# EasyEDA Pro project ProPrj_trying to make a watch__2026-06-22.epro, schematic Schematic1_7
Board Name: new board; Create Date: 2026-05-27; Page Name: P1; Project Name: trying to make a watch?; Schematic Name: Schematic1_7; Update Date: 2026-05-31; Company: EasyEDA.com; Page Size: A4; Version: V1.0
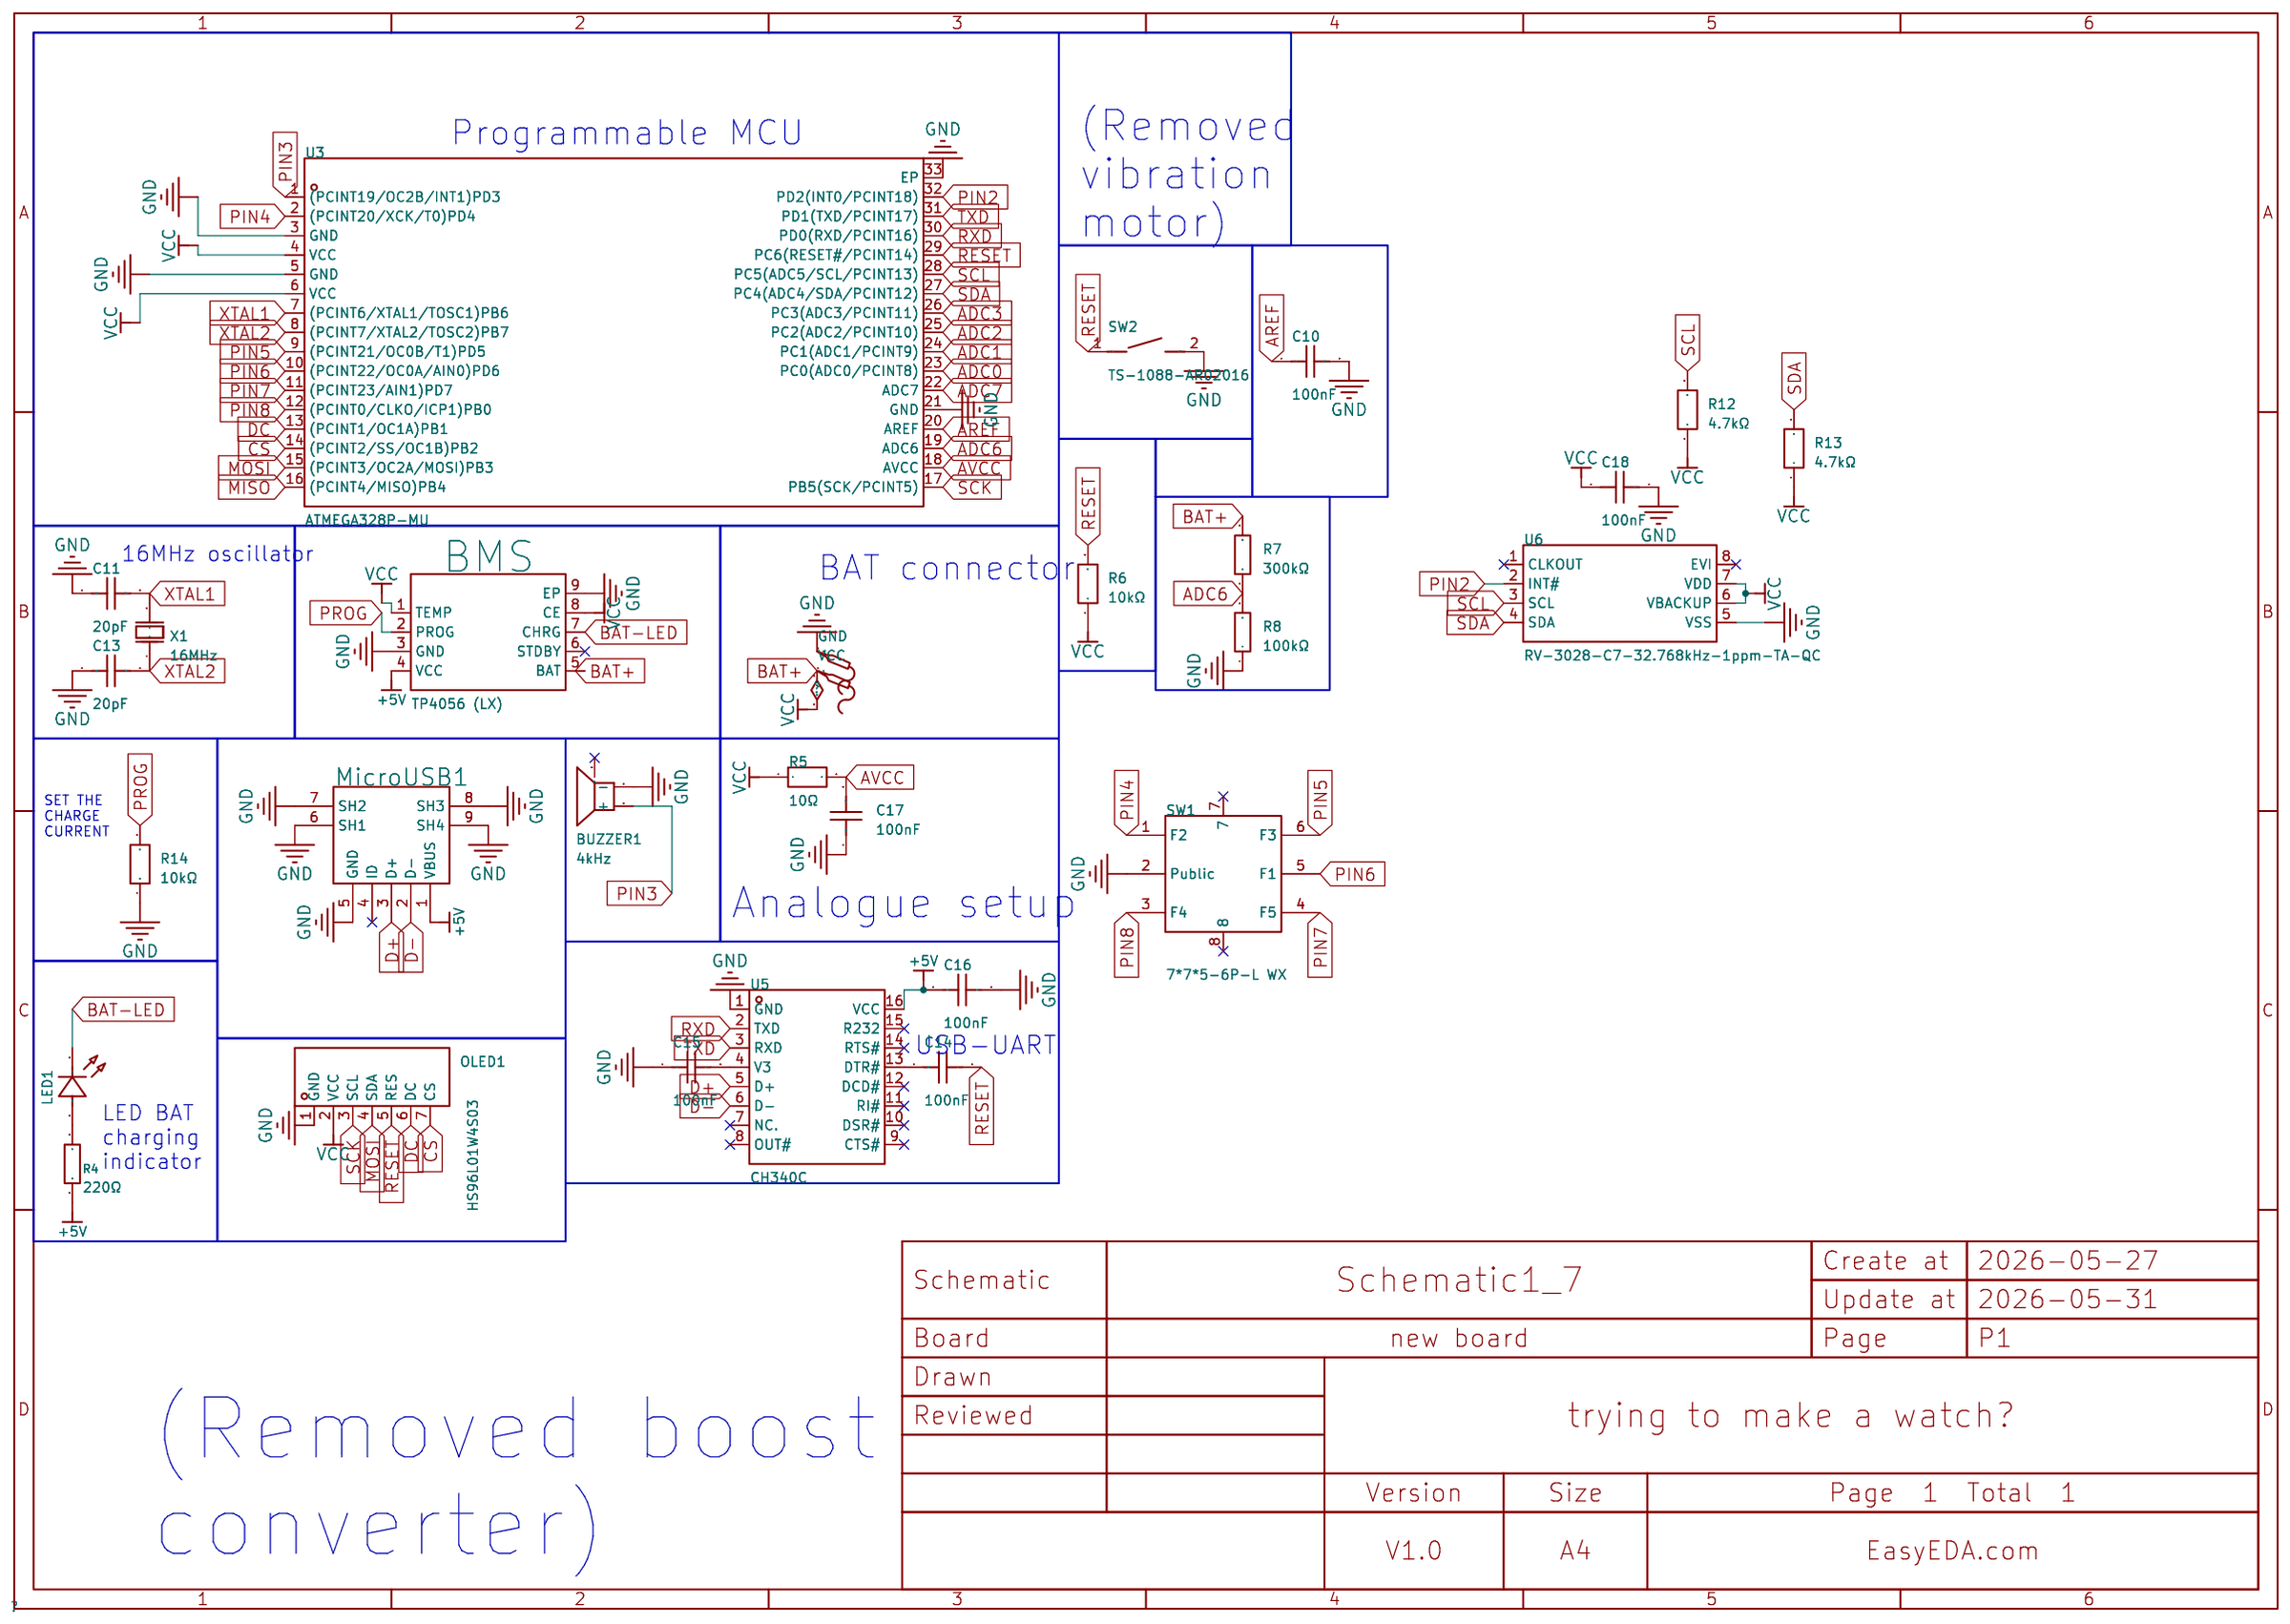
[diagram p0: schematic sheet]

## Parts
BMS  TP4056 (LX)  [ESOP-8_L4.9-W3.9-P1.27-LS6.0-BL-EP]
BUZZER1  4kHz  [BUZ-SMD_L5.0-W5.5-P4.60]
C10  100nF  [C0402]
C11  20pF  [C0402]
C13  20pF  [C0402]
C14  100nF  [C0402]
C15  100nF  [C0402]
C16  100nF  [C0402]
C17  100nF  [C0402]
C18  100nF  [C0402]
GND  -  [Test-Point-0.5mm]
LED1  XL-1608SURC-06  [LED0603-RD_RED]
MicroUSB1  MicroXNJ  [MICRO-USB-SMD_MICROXNJ_1]
OLED1  HS96L01W4S03  [OLED-TH_HS96L01W4S03]
R4  220Ω  [R0402]
R5  10Ω  [R0603]
R6  10kΩ  [R0402]
R7  300kΩ  [R0603]
R8  100kΩ  [R0402]
R12  4.7kΩ  [R0402]
R13  4.7kΩ  [R0402]
R14  10kΩ  [R0402]
SW1  7*7*5-6P-L WX  [SW-SMD_8P-L7.0-W7.0-P1.40-LS7.4-TL]
SW2  TS-1088-AR02016  [SW-SMD_L3.9-W3.0-P4.45]
U3  ATMEGA328P-MU  [HVQFN-32_L5.0-W5.0-P0.50-TL-EP3.1]
U5  CH340C  [SOP-16_L10.0-W3.9-P1.27-LS6.0-BL]
U6  RV-3028-C7-32.768kHz-1ppm-TA-QC  [OSC-SMD_8P-L3.2-W1.5-P0.90-BL]
VCC  -  [Test-Point-0.5mm]
X1  16MHz  [OSC-SMD_2P-L5.0-W3.2]

## Library data of the parts
BMS = TP4056 (LX): The Chip Type:Charging IC Voltage - Supply:4.5V~5.5V Voltage - Supply:4.5V~5.5V Charge Current - Max:1A Charging Saturation Voltage:4.2V End-Off Voltage:- Type of Battery:Lithium Battery Number of Cells:1 Number of Cells:1 Operating Temperature:-40℃~+85℃; LCSC Part Name: 1A线性锂电池充电电路; Supplier Part: C49246856; Manufacturer: LX(灵星芯微); Supplier Footprint: ESOP-8; JLCPCB Part Class: Extended Part; Datasheet: https://item.szlcsc.com/datasheet/TP4056%2520(LX)/51674740.html; Supplier: LCSC; The Chip Type: Charging IC; Voltage - Supply: 4.5V~5.5V; Charge Current - Max: 1A; Charging Saturation Voltage: 4.2V; Type of Battery: Lithium Battery; Number of Cells: 1; Operating Temperature: -40℃~+85℃; Battery Temperature Detection: Support; Supply Current (Iq): 70uA
BUZZER1 = MLT-5020: Driver Circuitry:Passive (Externally Driven) Technology:Electromagnetic Voltage Rating:3V Voltage - Supply:2V~4V Voltage - Supply:2V~4V Frequency:4kHz Current Consumption:100mA Sound Pressure Level(SPL):75dB Length:5.2mm Width:5.2mm Height:2.5mm Operating; LCSC Part Name: 无源(外部驱动) 电磁式 4kHz; Supplier Part: C94598; Manufacturer: 华能; Supplier Footprint: SMD,5x5mm; JLCPCB Part Class: Extended Part; Datasheet: https://item.szlcsc.com/datasheet/MLT-5020/95796.html; Supplier: LCSC; Driver Circuitry: Passive (Externally Driven); Technology: Electromagnetic; Voltage Rating: 3V; Voltage - Supply: 2V~4V; Current Consumption: 100mA; Sound Pressure Level(SPL): 75dB; Length: 5.2mm; Width: 5.2mm; Height: 2.5mm; Operating Temperature: -20℃~+70℃
C10 C14-C18 = CL05B104KO5NNNC: Capacitance:100nF Tolerance:±10% Tolerance:±10% Voltage Rating:16V Temperature Coefficient:X7R; LCSC Part Name: 100nF ±10% 16V; Supplier Part: C1525; Manufacturer: SAMSUNG(三星); Supplier Footprint: 0402; JLCPCB Part Class: Basic Part; Datasheet: https://item.szlcsc.com/datasheet/CL05B104KO5NNNC/1877.html; Supplier: LCSC; Tolerance: ±10%; Voltage Rating: 16V; Temperature Coefficient: X7R
C11 C13 = 0402CG200J500NT: Capacitance:20pF Tolerance:±5% Tolerance:±5% Voltage Rating:50V Temperature Coefficient:C0G; LCSC Part Name: 20pF ±5% 50V; Supplier Part: C1554; Manufacturer: FH(风华); Supplier Footprint: 0402; JLCPCB Part Class: Basic Part; Datasheet: https://item.szlcsc.com/datasheet/0402CG200J500NT/1906.html; Supplier: LCSC; Tolerance: ±5%; Voltage Rating: 50V; Temperature Coefficient: C0G
GND VCC = Test-Point: Test Point 测试点
LED1 = XL-1608SURC-06: Lamp Holder Type:- Illumination Color:Red Voltage - Forward(Vf):2.3V Voltage - Forward(Vf):2.3V Power(Watts):50mW Forward Current:20mA Wavelength - Dominant:620nm~630nm Wavelength - Dominant:620nm~630nm Peak Wavelength:625nm Diode Configuration:- Lens Col; Supplier Part: C965799; Manufacturer: XINGLIGHT(成兴光); Supplier Footprint: 0603; JLCPCB Part Class: Extended Part; Datasheet: https://atta.szlcsc.com/upload/public/pdf/source/20250213/F9766CE804AF391355DCDD48DB3E0DAB.pdf; Supplier: LCSC; Illumination Color: Red; Voltage - Forward(Vf): 2.3V; Power(Watts): 50mW; Forward Current: 20mA; Wavelength - Dominant: 620nm~630nm; Peak Wavelength: 625nm; Lens Color: Colorless Transparent Lens; Luminous Intensity: 225mcd; Viewing Angle: 120°; Mounting Sytle: Positive Stick; Operating Temperature: -20℃~+85℃
MicroUSB1 = MicroXNJ: Connector Type:Micro-B Protocol Standard:USB 2.0 Gender:Female Mounting Type:Surface Mount, Right Angle Number of Contacts:5P Number of Ports:1 Current Rating-Power:1.8A Voltage Rating:30V Connect-Disconnect Life:5,000 times Detection color:Black Operatin; LCSC Part Name: Micro小牛角卧贴母座; Supplier Part: C404969; Manufacturer: SHOU HAN(首韩); Supplier Footprint: SMD; JLCPCB Part Class: Extended Part; Datasheet: https://item.szlcsc.com/datasheet/MicroXNJ/392534.html; Supplier: LCSC; Connector Type: Micro-B; Protocol Standard: USB 2.0; Gender: Female; Mounting Type: Surface Mount, Right Angle; Number of Contacts: 5P; Number of Ports: 1; Current Rating-Power: 1.8A; Voltage Rating: 30V; Connect-Disconnect Life: 5,000 times; Detection color: Black; Operating Temperature: -20℃~+85℃
OLED1 = HS96L01W4S03: Size:0.96 Dot Pixels:128x64 Operating Temperature:-40℃~+80℃ Operating Temperature:-40℃~+80℃ Type of Drive:Passive (PMOLED) Display Range:21.74x10.86mm Display Color:White Luminance:100cd/m2 Quiescent Current:5uA; LCSC Part Name: 0.96寸 白光 128x64像素分辨率; Supplier Part: C5139758; Manufacturer: HS(汉昇); JLCPCB Part Class: Extended Part; Datasheet: https://item.szlcsc.com/datasheet/HS96L01W4S03/5751920.html; Supplier: LCSC; Size: 0.96; Dot Pixels: 128x64; Operating Temperature: -40℃~+80℃; Type of Drive: Passive (PMOLED); Display Range: 21.74x10.86mm; Display Color: White; Luminance: 100cd/m2; Quiescent Current: 5uA
R4 = 0402WGF2200TCE: Type:Thick Film Resistor Resistance:220Ω Tolerance:±1% Tolerance:±1% Power(Watts):62.5mW Voltage-Supply(Max):50V Temperature Coefficient:±100ppm/℃ Temperature Coefficient:±100ppm/℃ Operating Temperature:-55℃~+155℃ Operating Temperature:-55℃~+155℃; LCSC Part Name: 220Ω ±1% 62.5mW 厚膜电阻; Supplier Part: C25091; Manufacturer: UNI-ROYAL(厚声); Supplier Footprint: 0402; JLCPCB Part Class: Basic Part; Datasheet: https://item.szlcsc.com/datasheet/0402WGF2200TCE/25834.html; Supplier: LCSC; Type: Thick Film Resistor; Tolerance: ±1%; Power(Watts): 62.5mW; Voltage-Supply(Max): 50V; Temperature Coefficient: ±100ppm/℃; Operating Temperature: -55℃~+155℃
R5 = FRC0603J100 TS: Type:Thick Film Resistor Resistance:10Ω Tolerance:±5% Tolerance:±5% Power(Watts):100mW Voltage-Supply(Max):75V Temperature Coefficient:±100ppm/℃ Temperature Coefficient:±100ppm/℃ Operating Temperature:-55℃~+155℃ Operating Temperature:-55℃~+155℃; LCSC Part Name: 10Ω ±5% 100mW 厚膜电阻; Supplier Part: C2907091; Manufacturer: FOJAN(富捷); Supplier Footprint: 0603; JLCPCB Part Class: Extended Part; Supplier: LCSC; Type: Thick Film Resistor; Tolerance: ±5%; Power(Watts): 100mW; Voltage-Supply(Max): 75V; Temperature Coefficient: ±100ppm/℃; Operating Temperature: -55℃~+155℃
R6 R14 = AC0402FR-0710KL: Type:Thick Film Resistor Resistance:10kΩ Tolerance:±1% Tolerance:±1% Power(Watts):62.5mW Voltage-Supply(Max):50V Temperature Coefficient:±100ppm/℃ Temperature Coefficient:±100ppm/℃ Operating Temperature:-55℃~+155℃ Operating Temperature:-55℃~+155℃; LCSC Part Name: 厚膜电阻 10kΩ ±1% 62.5mW; Supplier Part: C144807; Manufacturer: YAGEO(国巨); Supplier Footprint: 0402; JLCPCB Part Class: Extended Part; Datasheet: https://item.szlcsc.com/datasheet/AC0402FR-0710KL/156139.html; Supplier: LCSC; Type: Thick Film Resistor; Tolerance: ±1%; Power(Watts): 62.5mW; Voltage-Supply(Max): 50V; Temperature Coefficient: ±100ppm/℃; Operating Temperature: -55℃~+155℃
R7 = FRC0603F3003TS: Type:Thick Film Resistor Resistance:300kΩ Tolerance:±1% Tolerance:±1% Power(Watts):100mW Voltage-Supply(Max):75V Temperature Coefficient:±100ppm/℃ Temperature Coefficient:±100ppm/℃ Operating Temperature:-55℃~+155℃ Operating Temperature:-55℃~+155℃; LCSC Part Name: 300kΩ ±1% 100mW 厚膜电阻; Supplier Part: C2930091; Manufacturer: FOJAN(富捷); Supplier Footprint: 0603; JLCPCB Part Class: Extended Part; Supplier: LCSC; Type: Thick Film Resistor; Tolerance: ±1%; Power(Watts): 100mW; Voltage-Supply(Max): 75V; Temperature Coefficient: ±100ppm/℃; Operating Temperature: -55℃~+155℃
R8 = RC0402FR-07100KL: Type:Thick Film Resistor Resistance:100kΩ Tolerance:±1% Tolerance:±1% Power(Watts):62.5mW Voltage-Supply(Max):50V Temperature Coefficient:±100ppm/℃ Temperature Coefficient:±100ppm/℃ Operating Temperature:-55℃~+155℃ Operating Temperature:-55℃~+155℃; LCSC Part Name: 厚膜电阻 100kΩ ±1% 62.5mW; Supplier Part: C60491; Manufacturer: YAGEO(国巨); Supplier Footprint: 0402; JLCPCB Part Class: Extended Part; Datasheet: https://item.szlcsc.com/datasheet/RC0402FR-07100KL/61543.html; Supplier: LCSC; Type: Thick Film Resistor; Tolerance: ±1%; Power(Watts): 62.5mW; Voltage-Supply(Max): 50V; Temperature Coefficient: ±100ppm/℃; Operating Temperature: -55℃~+155℃
R12 R13 = FRC0402F4701TS: Type:Thick Film Resistor Resistance:4.7kΩ Tolerance:±1% Tolerance:±1% Power(Watts):62.5mW Voltage-Supply(Max):50V Temperature Coefficient:±100ppm/℃ Temperature Coefficient:±100ppm/℃ Operating Temperature:-55℃~+155℃ Operating Temperature:-55℃~+155℃; LCSC Part Name: 4.7kΩ ±1% 62.5mW 厚膜电阻; Supplier Part: C2906869; Manufacturer: FOJAN(富捷); Supplier Footprint: 0402; JLCPCB Part Class: Extended Part; Supplier: LCSC; Type: Thick Film Resistor; Tolerance: ±1%; Power(Watts): 62.5mW; Voltage-Supply(Max): 50V; Temperature Coefficient: ±100ppm/℃; Operating Temperature: -55℃~+155℃
SW1 = 7*7*5-6P-L WX: Circuit:SP5T Mounting Type:Vertical welding Voltage Rating:12V Current Rating:50mA Mechanical Life:50,000 cycles Operating Temperature:-20℃~+70℃ Operating Temperature:-20℃~+70℃; LCSC Part Name: 7*7*5-6P贴片五向开关L型 编带; Supplier Part: C2858287; Manufacturer: SHOU HAN(首韩); Supplier Footprint: SMD-6P,7x7mm; JLCPCB Part Class: Extended Part; Datasheet: https://item.szlcsc.com/datasheet/7*7*5-6P-L%2520WX/3059437.html; Supplier: LCSC; Circuit: SP5T; Mounting Type: Vertical welding; Voltage Rating: 12V; Current Rating: 50mA; Mechanical Life: 50,000 cycles; Operating Temperature: -20℃~+70℃
SW2 = TS-1088-AR02016: Circuit:SPST Actuator Style:Round Button Operating Force:1.6N Mounting Type:Surface Mount,Vertical Length:4mm Width:3mm Switch Height:2mm with Bracket:Without Bracket Contact Current:50mA Voltage Rating:12V Actuator/Cap Color:Black Termination Style:SMD(S; LCSC Part Name: 4*3*2mm 立贴 轻触开关; Supplier Part: C720477; Manufacturer: XUNPU(讯普); Supplier Footprint: SMD,4x3mm; JLCPCB Part Class: Basic Part; Datasheet: https://item.szlcsc.com/datasheet/TS-1088-AR02016/763484.html; Supplier: LCSC; Circuit: SPST; Actuator Style: Round Button; Operating Force: 1.6N; Mounting Type: Surface Mount,Vertical; Length: 4mm; Width: 3mm; Switch Height: 2mm; with Bracket: Without Bracket; Contact Current: 50mA; Voltage Rating: 12V; Actuator/Cap Color: Black; Termination Style: SMD(SMT) Tab; Life: 100,000 Cycles; Operating Temperature: -30℃~+80℃
U3 = ATMEGA328P-MU_C7499261: CPU Core:AVR CPU Maximum Speed:20MHz Core Size:8 Bit Program Storage Size:32KB Program Memory Type:FLASH RAM Size:2KB EEPROM:1KB Number of I/O:23 ADC (Bit):10bit Oscillator Type:Built-in Voltage - Supply:1.8V~5.5V Voltage - Supply:1.8V~5.5V Operating Temp; LCSC Part Name: 低功耗CMOS 8位微控制器; Supplier Part: C7499261; Manufacturer: MICROCHIP(美国微芯); Supplier Footprint: VQFN-32(5x5); JLCPCB Part Class: Extended Part; Datasheet: https://item.szlcsc.com/datasheet/ATMEGA328P-MU/8573735.html; Supplier: LCSC; CPU Core: AVR; CPU Maximum Speed: 20MHz; Core Size: 8 Bit; Program Storage Size: 32KB; Program Memory Type: FLASH; RAM Size: 2KB; EEPROM: 1KB; Number of I/O: 23; ADC (Bit): 10bit; Oscillator Type: Built-in; Voltage - Supply: 1.8V~5.5V; Operating Temperature: -40℃~+85℃; Features: Undervoltage detection (BOR/LVD/LVR/LVI)；Power-on reset (POR)；Watchdog reset；Built-in general-purpose timer；Built-in temperature sensor；Programmable watchdog；Touch function；External pin reset (NRST)
U5 = CH340C: Applications Function:Transceiver USB Protocol:USB 2.0 Voltage - Supply:3.3V；5V Voltage - Supply:3.3V；5V Data Rate:2Mbps Operating Temperature:-20℃~+70℃ Operating Temperature:-20℃~+70℃ Current - Supply:7mA Supply Current (Iq):50uA; LCSC Part Name: USB转串口芯片; Supplier Part: C84681; Manufacturer: WCH(南京沁恒); Supplier Footprint: SOP-16; JLCPCB Part Class: Extended Part; Datasheet: https://item.szlcsc.com/datasheet/CH340C/85852.html; Supplier: LCSC; Applications Function: Transceiver; USB Protocol: USB 2.0; Voltage - Supply: 3.3V；5V; Data Rate: 2Mbps; Operating Temperature: -20℃~+70℃; Current - Supply: 7mA; Supply Current (Iq): 50uA
U6 = RV-3028-C7-32.768kHz-1ppm-TA-QC: Interface:I2C Voltage - Supply:1.1V~5.5V Voltage - Supply:1.1V~5.5V Current - Supply:45nA crystal oscillator:Built-in Alarm Output:Yes Operating Temperature:-40℃~+85℃ Operating Temperature:-40℃~+85℃ Quiescent Current(Iq):45nA; LCSC Part Name: RV-3028-C7 32.768kHz 1ppm TA QC; Supplier Part: C3019759; Manufacturer: Micro Crystal(瑞士微晶); Supplier Footprint: SMD3215-8P; JLCPCB Part Class: Extended Part; Datasheet: https://www.microcrystal.com/fileadmin/Media/Products/RTC/Datasheet/RV-3028-C7.pdf; Supplier: LCSC; Interface: I2C; Voltage - Supply: 1.1V~5.5V; Current - Supply: 45nA; crystal oscillator: Built-in; Alarm Output: Yes; Operating Temperature: -40℃~+85℃; Quiescent Current(Iq): 45nA
X1 = XSHEELNANF-16MHZ: Type:Surface Mount Crystal Frequency:16MHz Normal temperature Frequency Tolerance:±30ppm Normal temperature Frequency Tolerance:±30ppm Load Capacitance:20pF Frequency Stability:±30ppm Frequency Stability:±30ppm Operating Temperature:-40℃~+85℃ Operating Te; LCSC Part Name: 16MHz ±30ppm 20pF; Supplier Part: C242221; Manufacturer: TAITIEN(泰艺电子); Supplier Footprint: SMD5032; JLCPCB Part Class: Extended Part; Datasheet: https://atta.szlcsc.com/upload/public/pdf/source/20180704/C242221_71476AA24F58019514D39B5873D4BE18.pdf; Supplier: LCSC; Type: Surface Mount Crystal; Normal temperature Frequency Tolerance: ±30ppm; Load Capacitance: 20pF; Frequency Stability: ±30ppm; Operating Temperature: -40℃~+85℃

## Nets
+5V: BMS.4(VCC) C16.1 MicroUSB1.1(VBUS) R4.1 U5.16(VCC)
AVCC: C17.2 R5.2 U3.18(AVCC)
GND: BMS.3(GND) BMS.9(EP) BUZZER1.2(-) C10.2 C11.1 C13.1 C15.1 C16.2 C17.1 C18.1 GND.1 MicroUSB1.5(GND) MicroUSB1.6(SH1) MicroUSB1.7(SH2) MicroUSB1.8(SH3) MicroUSB1.9(SH4) OLED1.1(GND) R8.1 R14.1 SW1.2(Public) SW2.2 U3.3(GND) U3.5(GND) U3.21(GND) U3.33(EP) U5.1(GND) U6.5(VSS)
VCC: BMS.1(TEMP) BMS.5(BAT) BMS.8(CE) C18.2 OLED1.2(VCC) R5.1 R6.1 R7.2 R12.1 R13.1 U3.4(VCC) U3.6(VCC) U6.6(VBACKUP) U6.7(VDD) VCC.1
ADC0: U3.23(PC0(ADC0/PCINT8))
ADC1: U3.24(PC1(ADC1/PCINT9))
ADC2: U3.25(PC2(ADC2/PCINT10))
ADC3: U3.26(PC3(ADC3/PCINT11))
ADC6: R7.1 R8.2 U3.19(ADC6)
ADC7: U3.22(ADC7)
AREF: C10.1 U3.20(AREF)
BAT-LED: BMS.7(CHRG) LED1.1(K)
CS: OLED1.7(CS) U3.14((PCINT2/SS/OC1B)PB2)
D+: MicroUSB1.3(D+) U5.5(D+)
D-: MicroUSB1.2(D-) U5.6(D-)
DC: OLED1.6(DC) U3.13((PCINT1/OC1A)PB1)
MISO: U3.16((PCINT4/MISO)PB4)
MOSI: OLED1.4(SDA) U3.15((PCINT3/OC2A/MOSI)PB3)
PIN2: U3.32(PD2(INT0/PCINT18)) U6.2(INT#)
PIN3: BUZZER1.1(+) U3.1((PCINT19/OC2B/INT1)PD3)
PIN4: SW1.1(F2) U3.2((PCINT20/XCK/T0)PD4)
PIN5: SW1.6(F3) U3.9((PCINT21/OC0B/T1)PD5)
PIN6: SW1.5(F1) U3.10((PCINT22/OC0A/AIN0)PD6)
PIN7: SW1.4(F5) U3.11((PCINT23/AIN1)PD7)
PIN8: SW1.3(F4) U3.12((PCINT0/CLKO/ICP1)PB0)
PROG: BMS.2(PROG) R14.2
RESET: C14.2 OLED1.5(RES) R6.2 SW2.1 U3.29(PC6(RESET#/PCINT14))
RXD: U3.30(PD0(RXD/PCINT16)) U5.2(TXD)
SCK: OLED1.3(SCL) U3.17(PB5(SCK/PCINT5))
SCL: R12.2 U3.28(PC5(ADC5/SCL/PCINT13)) U6.3(SCL)
SDA: R13.2 U3.27(PC4(ADC4/SDA/PCINT12)) U6.4(SDA)
TXD: U3.31(PD1(TXD/PCINT17)) U5.3(RXD)
XTAL1: C11.2 U3.7((PCINT6/XTAL1/TOSC1)PB6) X1.2(OSC2)
XTAL2: C13.2 U3.8((PCINT7/XTAL2/TOSC2)PB7) X1.1(OSC1)
$1N13873: LED1.2(A) R4.2
$1N25972: C14.1 U5.13(DTR#)
$1N26008: C15.2 U5.4(V3)

Not connected (* = marked no-connect by the designer): BMS 6(STDBY)*; BUZZER1 3(NC)*; MicroUSB1 4(ID)*; SW1 7* 8*; U5 7(NC.)* 8(OUT#)* 9(CTS#)* 10(DSR#)* 11(RI#)* 12(DCD#)* 14(RTS#)* 15(R232)*; U6 1(CLKOUT)* 8(EVI)*

## Notes on the sheet
- (Removed
  vibration
  motor)
- Programmable MCU
- 16MHz oscillator
- BAT connector
- SET THE
  CHARGE
  CURRENT
- Analogue setup
- USB-UART
- LED BAT
  charging
  indicator
- (Removed boost
  converter)
